# EAGLE schematic ACCUM-SIGNAL (EAGLE 9.4.2)
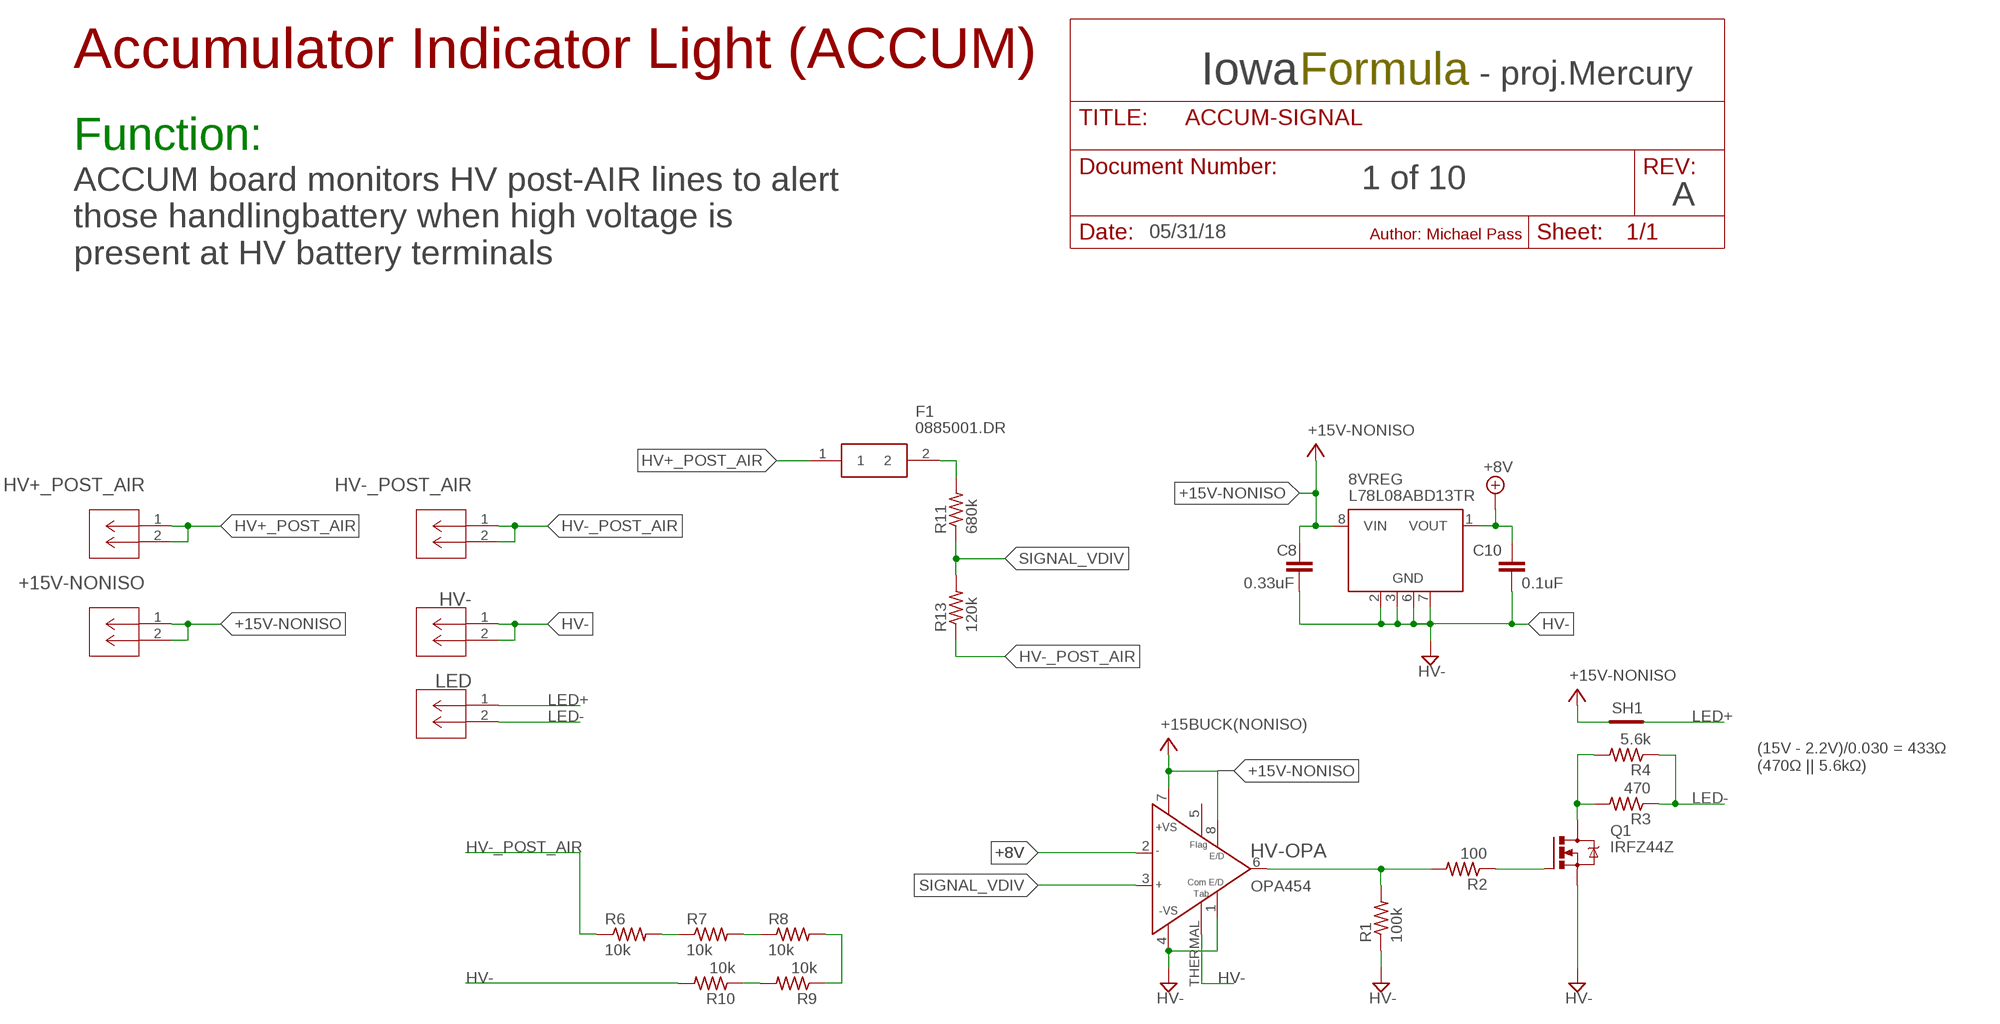
[diagram p0: schematic, sheet 1]

## Parts
8VREG  L78L08ABD13TR  78L08SMD  [SO08]
+15V-NONISO  2P(90DEG)_1-770966-0  [CON2_1X2_P163_RAMNL]
C8  0.33uF  C-EUC0805  [C0805]
C10  0.1uF  C-EUC0805  [C0805]
F1  0885001.DR  [FUSC10948X488N]
HV+_POST_AIR  2P(90DEG)_1-770966-0  [CON2_1X2_P163_RAMNL]
HV-  2P(90DEG)_1-770966-0  [CON2_1X2_P163_RAMNL]
HV-_POST_AIR  2P(90DEG)_1-770966-0  [CON2_1X2_P163_RAMNL]
HV-OPA  OPA454  [SO08GP]
LED  2P(90DEG)_1-770966-0  [CON2_1X2_P163_RAMNL]
Q1  IRFZ44Z  IRLZ44Z  [TO220BH]
R1  100k  R-US_R0805  [R0805]
R2  100  R-US_R0805  [R0805]
R3  470  R-US_R0805  [R0805]
R4  5.6k  R-US_R0805  [R0805]
R6  10k  R-US_R0805  [R0805]
R7  10k  R-US_R0805  [R0805]
R8  10k  R-US_R0805  [R0805]
R9  10k  R-US_R0805  [R0805]
R10  10k  R-US_R0805  [R0805]
R11  680k  R-US_R0805  [R0805]
R13  120k  R-US_R0805  [R0805]
SH1  SHORTT5  [SHORT_TOP-50]

## Nets
+8V: 8VREG.1(VOUT) C10.1 HV-OPA.2(IN-)
+15V-NONISO: 8VREG.8(VIN) +15V-NONISO.1 +15V-NONISO.2 C8.1 HV-OPA.7(+VS) HV-OPA.8(E/D) SH1.1 ; supply symbol labelled +15BUCK(NONISO)
HV+_POST_AIR: F1.1 HV+_POST_AIR.1 HV+_POST_AIR.2
HV-: 8VREG.2(GND) 8VREG.3(GND) 8VREG.6(GND) 8VREG.7(GND) C8.2 C10.2 HV-.1 HV-.2 HV-OPA.1(E/DCOM) HV-OPA.4(-VS) HV-OPA.THERMAL(E/DCOM1) Q1.S R1.1 R10.2
HV-_POST_AIR: HV-_POST_AIR.1 HV-_POST_AIR.2 R6.1 R13.1
LED+: LED.1 SH1.2
LED-: LED.2 R3.1 R4.1
N$1: Q1.D R3.2 R4.2
N$2: F1.2 R11.2
N$3: Q1.G R2.1
N$4: R7.2 R8.1
N$5: R6.2 R7.1
N$7: R8.2 R9.1
N$8: R9.2 R10.1
N$9: HV-OPA.6(OUT) R1.2 R2.2
SIGNAL_VDIV: HV-OPA.3(IN+) R11.1 R13.2
Unconnected: 8VREG.4(NC) 8VREG.5(NC) HV-OPA.5(STATUS)

## Notes on the sheet
- Accumulator Indicator Light (ACCUM)
- Iowa | Formula | - proj.Mercury
- Function:
- 1 of 10
- A
- 05/31/18 | Author: Michael Pass
- ACCUM board monitors HV post-AIR lines to alert
  those handlingbattery when high voltage is 
  present at HV battery terminals
- (15V - 2.2V)/0.030 = 433Ω
  (470Ω || 5.6kΩ)

## Library data of the parts
8VREG = linear:78L*SMD: Positive VOLTAGE REGULATOR
+15V-NONISO HV+_POST_AIR HV- HV-_POST_AIR LED = con-MATE-N-LOK:2P(90DEG)_1-770966-0; MANUFACTURER_PART_NUMBER: 17709660; VENDOR: TE Connectivity
C8 C10 = rcl:C-EU: CAPACITOR, European symbol; SPICEPREFIX: C
F1 = 0885001.DR:0885001.DR: LITTELFUSE - 0885001.DR - FUSE, AEC-Q200, 1A, 500VDC, 0402 Source: Datasheet <https://m.littelfuse.com/~/media/electronics/datasheets/fuses/littelfuse_fuse_885_datasheet.pdf.pdf>; DESCRIPTION: LITTELFUSE - 0885001.DR - FUSE, AEC-Q200, 1A, 500VDC, 0402; HEIGHT: 4.88mm; MANUFACTURER_NAME: LITTELFUSE; MANUFACTURER_PART_NUMBER: 0885001.DR; MOUSER_PART_NUMBER: 576-0885001.DR; MOUSER_PRICE-STOCK: https://www.mouser.com/Search/Refine.aspx?Keyword=576-0885001.DR
HV-OPA = OPA454:OPA454: TexasInstruments High-Voltage (100V), High-Current (50mA) Operatioanl Amplifier, G = 1 Stable http://focus.ti.com/lit/ds/symlink/opa454.pdf; AVAILABILITY: Unavailable; DESCRIPTION: High Voltage _100V_ High-Current _50mA_ Operational Amplifiers G=1 Stable; MF: Texas Instruments; MP: OPA454; PACKAGE: None; PRICE: None
Q1 = transistor-power:IRLZ44Z: N-Channel HEXFET® Power MOSFET Logic Level AUTOMOTIVE MOSFET Source: http://www.irf.com/product-info/datasheets/data/irlz44zpbf.pdf
R1-R4 R6-R11 R13 = rcl:R-US_: RESISTOR, American symbol; SPICEPREFIX: R
SH1 = shorts:SHORT: Short between two nets; BOM: no